# Altium schematic sheet Datalogger.SchDoc
size A3
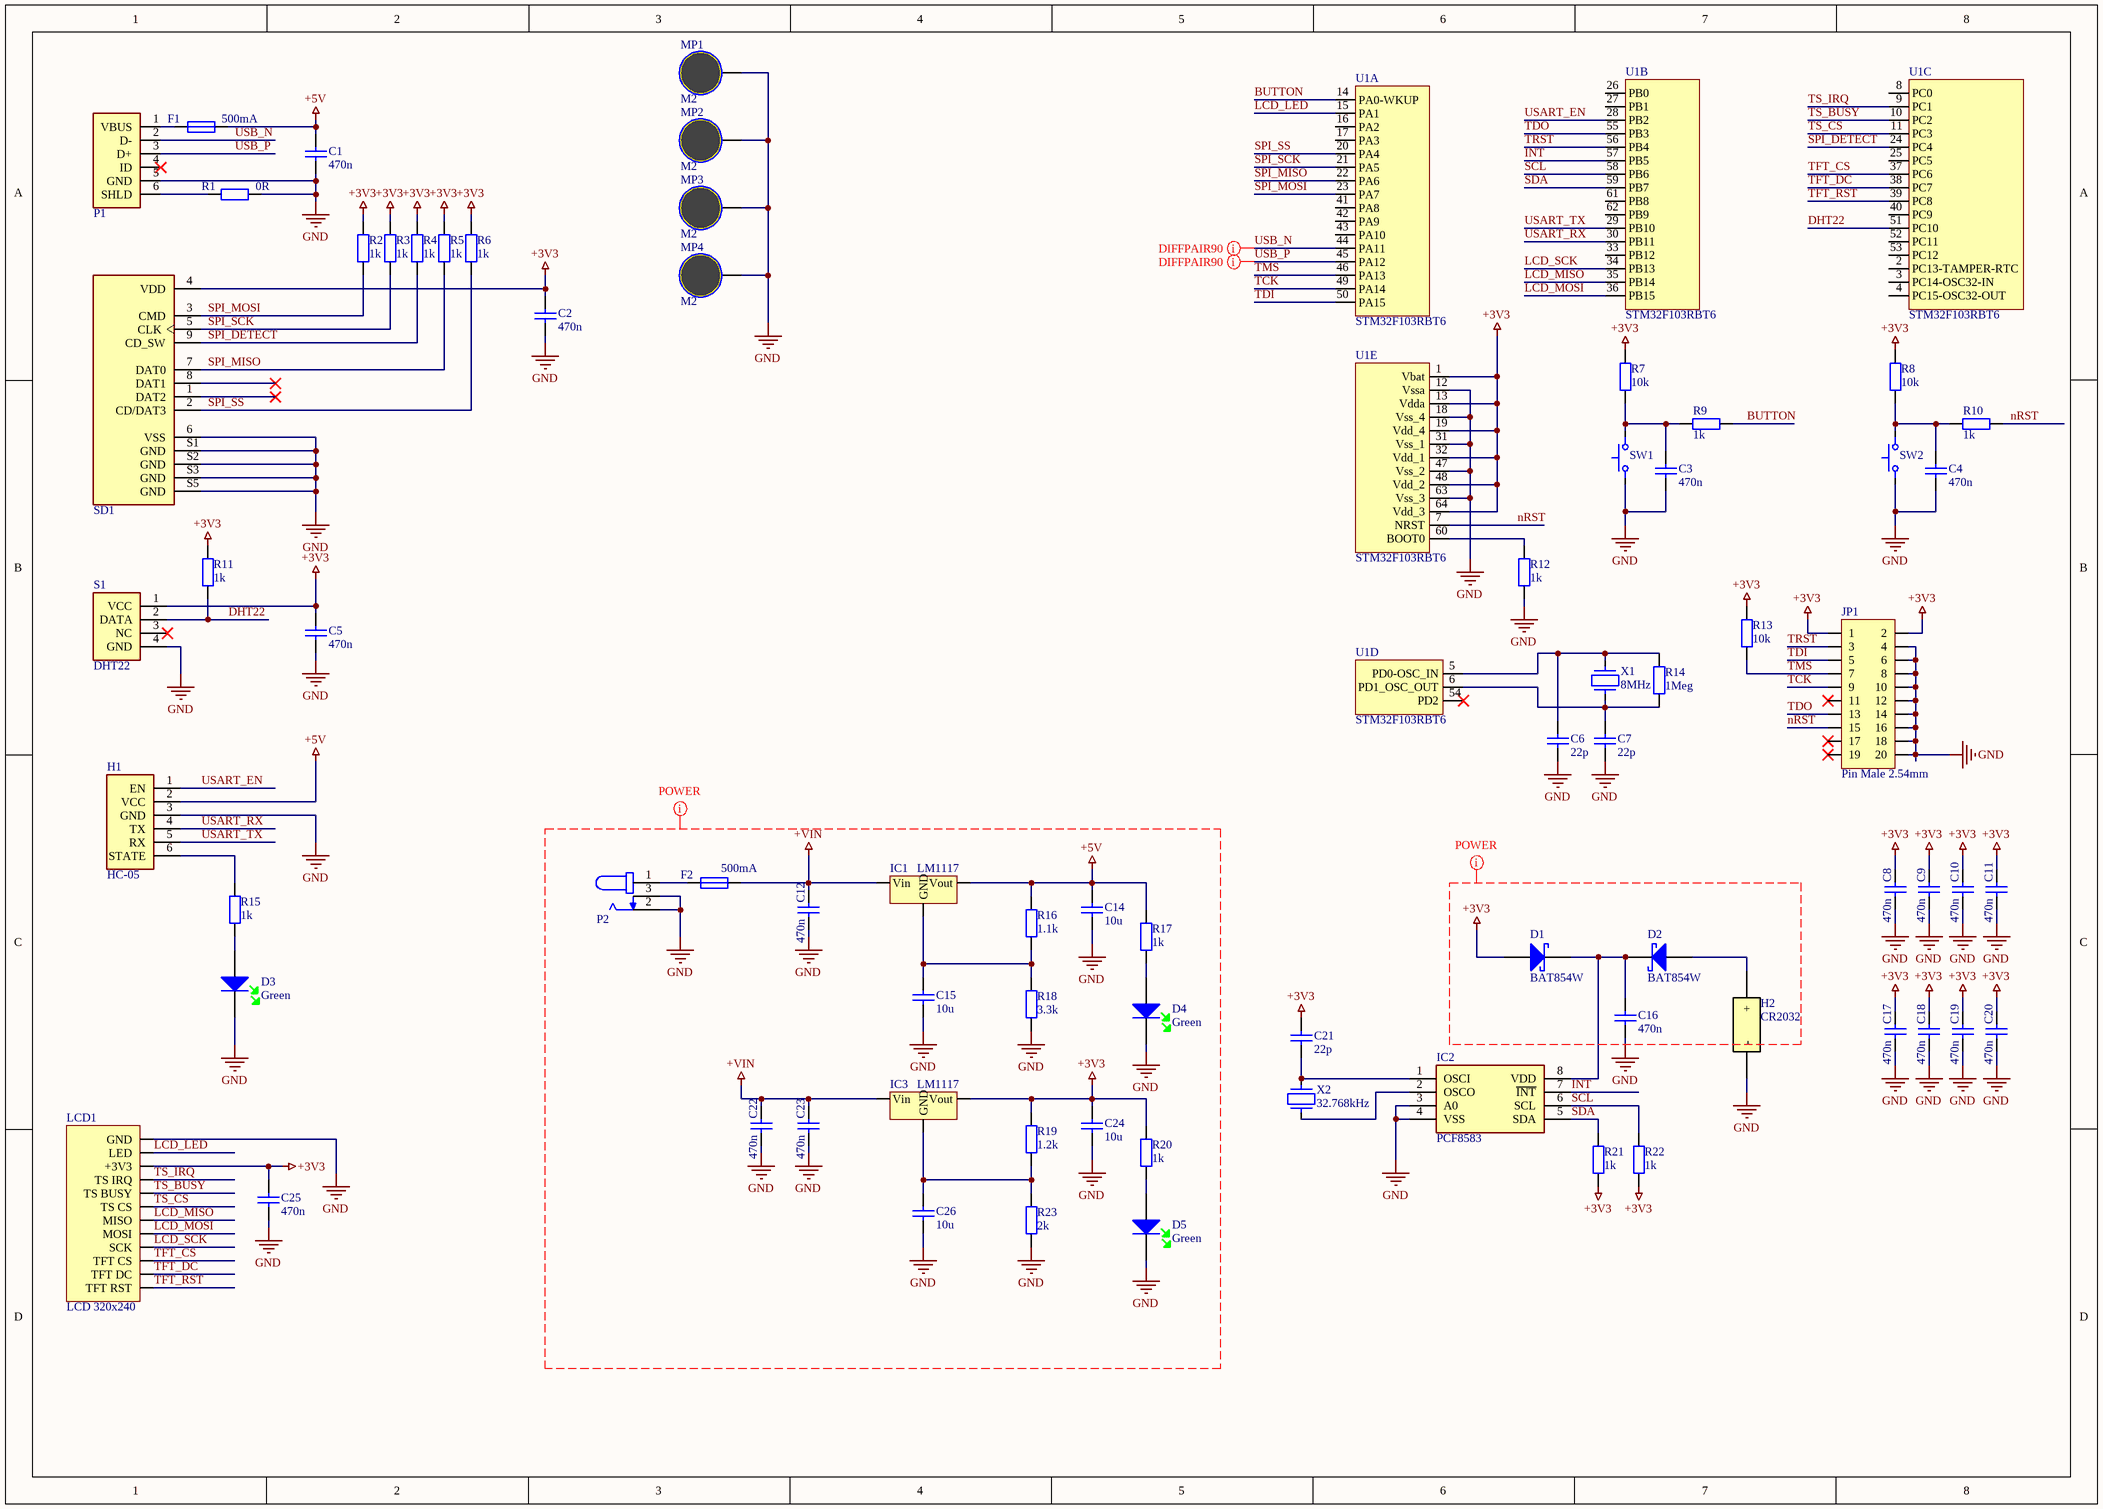
[diagram p0: Datalogger.SchDoc]

## Parts
C1  470n  [Capacitor 0603]
C2  470n  [Capacitor 0603]
C3  470n  [Capacitor 0603]
C4  470n  [Capacitor 0603]
C5  470n  [Capacitor 0603]
C6  22p  [Capacitor 0603]
C7  22p  [Capacitor 0603]
C8  470n  [Capacitor 0603]
C9  470n  [Capacitor 0603]
C10  470n  [Capacitor 0603]
C11  470n  [Capacitor 0603]
C12  470n  [Capacitor 0603]
C14  10u  [Capacitor 0603]
C15  10u  [Capacitor 0603]
C16  470n  [Capacitor 0603]
C17  470n  [Capacitor 0603]
C18  470n  [Capacitor 0603]
C19  470n  [Capacitor 0603]
C20  470n  [Capacitor 0603]
C21  22p  [Capacitor 0603]
C22  470n  [Capacitor 0603]
C23  470n  [Capacitor 0603]
C24  10u  [Capacitor 0603]
C25  470n  [Capacitor 0603]
C26  10u  [Capacitor 0603]
D1  BAT854W  [SOT323_BAT]
D2  BAT854W  [SOT323_BAT]
D3  Green  [Diode LED 0603 G]
D4  Green  [Diode LED 0603 G]
D5  Green  [Diode LED 0603 G]
F1  500mA  [Fuse 0805]
F2  500mA  [Fuse 0805]
H1  HC-05  [HC05]
H2  CR2032  [CR2032 HOLDER]
IC1  LM1117  [ic lm1117]
IC2  PCF8583  [SOIC8]
IC3  LM1117  [ic lm1117]
JP1  Pin Male 2.54mm  [20 pin 2.54mm male THT JTAG]
LCD1  LCD 320x240  [LCD_PINS]
MP1  M2  [Mechanical screw M2]
MP2  M2  [Mechanical screw M2]
MP3  M2  [Mechanical screw M2]
MP4  M2  [Mechanical screw M2]
P1  Mechanical MICRO USB AB 5P SMD RA  [Mechanical microUSB]  (value not drawn)
P2  Mechanical PWR JACK 2X5.5MM SOLDER  [Mechanical CUI_PJ-002A]  (value not drawn)
R1  0R  [Resistor 0603]
R2  1k  [Resistor 0603]
R3  1k  [Resistor 0603]
R4  1k  [Resistor 0603]
R5  1k  [Resistor 0603]
R6  1k  [Resistor 0603]
R7  10k  [Resistor 0603]
R8  10k  [Resistor 0603]
R9  1k  [Resistor 0603]
R10  1k  [Resistor 0603]
R11  1k  [Resistor 0603]
R12  1k  [Resistor 0603]
R13  10k  [Resistor 0603]
R14  1Meg  [Resistor 0603]
R15  1k  [Resistor 0603]
R16  1.1k  [Resistor 0603]
R17  1k  [Resistor 0603]
R18  3.3k  [Resistor 0603]
R19  1.2k  [Resistor 0603]
R20  1k  [Resistor 0603]
R21  1k  [Resistor 0603]
R22  1k  [Resistor 0603]
R23  2k  [Resistor 0603]
S1  DHT22  [DHT22]
SD1  Mechanical microSD DM3CS-SF  [Mechanical SD card]  (value not drawn)
SW1  Mechanical Pushbutton Panel Mount  [TACTSWITCH SMD 6x6]  (value not drawn)
SW2  Mechanical Pushbutton Panel Mount  [TACTSWITCH SMD 6x6]  (value not drawn)
U1  STM32F103RBT6  [LQFP64]  (parts A,B,C,D,E of 5)
X1  8MHz  [8MHZ SMD]
X2  32.768kHz  [32.768kHz THT]

## Nets
+3V3: C2.2 C5.2 C8.2 C9.2 C10.2 C11.2 C17.2 C18.2 C19.2 C20.2 C21.2 C24.2 C25.2 D1.1 IC3.2(Vout) JP1.1 JP1.2 LCD1.3(+3V3) R2.2 R3.2 R4.2 R5.2 R6.2 R7.2 R8.2 R11.2 R13.2 R19.2 R20.2 R21.1 R22.1 S1.1(VCC) SD1.4(VDD) U1.1(Vbat) U1.13(Vdda) U1.19(Vdd_4) U1.32(Vdd_1) U1.48(Vdd_2) U1.64(Vdd_3)
+5V: C1.2 C14.2 F1.2 H1.2(VCC) IC1.2(Vout) R16.2 R17.2
+VIN: C12.2 C22.2 C23.2 F2.2 IC1.3(Vin) IC3.3(Vin)
GND: C1.1 C2.1 C3.1 C4.1 C5.1 C6.1 C7.1 C8.1 C9.1 C10.1 C11.1 C12.1 C14.1 C15.1 C16.1 C17.1 C18.1 C19.1 C20.1 C22.1 C23.1 C24.1 C25.1 C26.1 D3.1 D4.1 D5.1 H1.3(GND) H2.1(-) IC2.3(A0) IC2.4(VSS) JP1.4 JP1.6 JP1.8 JP1.10 JP1.12 JP1.14 JP1.16 JP1.18 JP1.20 LCD1.1(GND) MP1.0 MP2.0 MP3.0 MP4.0 P1.5(GND) P2.2 P2.3 R1.2 R12.1 R18.1 R23.1 S1.4(GND) SD1.6(VSS) SD1.S1(GND) SD1.S2(GND) SD1.S3(GND) SD1.S5(GND) SW1.1 SW2.1 U1.12(Vssa) U1.18(Vss_4) U1.31(Vss_1) U1.47(Vss_2) U1.63(Vss_3)
BUTTON: R9.2 U1.14(PA0-WKUP)
DHT22: R11.1 S1.2(DATA) U1.51(PC10)
~{INT}: IC2.7(~{INT}) U1.57(PB5)
LCD_LED: LCD1.2(LED) U1.15(PA1)
LCD_MISO: LCD1.7(MISO) U1.35(PB14)
LCD_MOSI: LCD1.8(MOSI) U1.36(PB15)
LCD_SCK: LCD1.9(SCK) U1.34(PB13)
nRST: JP1.15 R10.2 U1.7(NRST)
SCL: IC2.6(SCL) R22.2 U1.58(PB6)
SDA: IC2.5(SDA) R21.2 U1.59(PB7)
SPI_DETECT: R4.1 SD1.9(CD_SW) U1.24(PC4)
SPI_MISO: R5.1 SD1.7(DAT0) U1.22(PA6)
SPI_MOSI: R2.1 SD1.3(CMD) U1.23(PA7)
SPI_SCK: R3.1 SD1.5(CLK) U1.21(PA5)
SPI_SS: R6.1 SD1.2(CD/DAT3) U1.20(PA4)
TCK: JP1.9 U1.49(PA14)
TDI: JP1.5 U1.50(PA15)
TDO: JP1.13 U1.55(PB3)
TFT_CS: LCD1.10(TFT_CS) U1.37(PC6)
TFT_DC: LCD1.11(TFT_DC) U1.38(PC7)
TFT_RST: LCD1.12(TFT_RST) U1.39(PC8)
TMS: JP1.7 R13.1 U1.46(PA13)
TRST: JP1.3 U1.56(PB4)
TS_BUSY: LCD1.5(TS_BUSY) U1.10(PC2)
TS_CS: LCD1.6(TS_CS) U1.11(PC3)
TS_IRQ: LCD1.4(TS_IRQ) U1.9(PC1)
USART_EN: H1.1(EN) U1.28(PB2)
USART_RX: H1.4(TX) U1.30(PB11)
USART_TX: H1.5(RX) U1.29(PB10)
USB_N: P1.2(D-) U1.44(PA11)
USB_P: P1.3(D+) U1.45(PA12)
NetC3_2: C3.2 R7.1 R9.1 SW1.2
NetC4_2: C4.2 R8.1 R10.1 SW2.2
NetC6_2: C6.2 R14.2 U1.5(PD0-OSC_IN) X1.2
NetC7_2: C7.2 R14.1 U1.6(PD1_OSC_OUT) X1.1
NetC15_2: C15.2 IC1.1(GND) R16.1 R18.2
NetC16_2: C16.2 D1.3 D2.3 IC2.8(VDD)
NetC21_1: C21.1 IC2.1(OSCI) X2.2
NetC26_2: C26.2 IC3.1(GND) R19.1 R23.2
NetD2_1: D2.1 H2.2(+)
NetD3_2: D3.2 R15.1
NetD4_2: D4.2 R17.1
NetD5_2: D5.2 R20.1
NetF1_1: F1.1 P1.1(VBUS)
NetF2_1: F2.1 P2.1
NetH1_6: H1.6(STATE) R15.2
NetIC2_2: IC2.2(OSCO) X2.1
NetP1_6: P1.6(SHLD) R1.1
NetR12_2: R12.2 U1.60(BOOT0)

Not connected (* = marked no-connect by the designer): JP1 11* 17* 19*; P1 4(ID)*; S1 3(NC)*; SD1 1(DAT2)* 8(DAT1)*; U1 2(PC13-TAMPER-RTC) 3(PC14-OSC32-IN) 4(PC15-OSC32-OUT) 8(PC0) 16(PA2) 17(PA3) 25(PC5) 26(PB0) 27(PB1) 33(PB12) 40(PC9) 41(PA8) 42(PA9) 43(PA10) 52(PC11) 53(PC12) 54(PD2)* 61(PB8) 62(PB9)

## Layout directives
net class POWER: +3V3, +5V, +VIN, GND
differential pair: USB_N, USB_P

## Library data of the parts
C1-C5 C25 = Capacitor 470n: Cap Ceramic 0.47uF 50V Y5V -20% to 80% SMD 0603 85C Paper T/R; Manufacturer: Samsung; Manufacturer Part Number: CL10F474ZB8NNNC; Capacitance: 470nF; Supplier 1: Arrow; Stock 1: 53041; Pricing 1: 1=0.1235, 10=0.0893, 25=0.0884, 100=0.0414, 250=0.0409, 500=0.0284, 1000=0.0233, 3000=0.0195, 6000=0.0148, 15000=0.0147, 30000=0.0138, 200000=0.014, 300000=0.0138, 400000=0.0137, 500000=0.0135, 4000=0.0244 (USD); Mount: Surface Mount; Case/Package: 0603; Case Code (Metric): 1608; Case Code (Imperial): 0603; Min Operating Temperature: -30°C; Max Operating Temperature: 85°C; Tolerance: 80%; Package Quantity: 1; Packaging: Tape and Reel; Voltage Rating: 50V; Dielectric: Y5V; Voltage Rating (DC): 50V; Length: 1.6mm; Height: 0.8mm; Width: 0.031inch; Thickness: 0.035inch; Depth: 0.8mm; Radiation Hardening: No; ComponentLink1URL: http://www.samsungsem.com/kr/support/library/product-catalog/mlcc.jsp?src-supplier=Digi-Key; ComponentLink1Description: http://www.samsungsem.com/kr/support/library/product-catalog/mlcc.jsp?src-supplier=Digi-Key; Supplier Part Number 1: CL10F474ZB8NNNC
C6 C7 C21 = Capacitor 22p 0603
C8-C12 C16-C20 C22 C23 = Capacitor 470n 0603
C14 C15 C24 C26 = Capacitor 10u 0603
D1 D2 = Diode BAT854W: DIODE SCHOTTKY 40V 200MA SOT323; Manufacturer: Nexperia; Manufacturer Part Number: BAT854W,115; Supplier 1: Digi-Key; Stock 1: 6583; Pricing 1: 1=0.3, 10=0.249, 25=0.2088, 100=0.102, 250=0.10036, 500=0.08508, 1000=0.05911 (USD); ComponentLink1URL: http://www.farnell.com/datasheets/2342726.pdf?src-supplier=Farnell; ComponentLink1Description: http://www.farnell.com/datasheets/2342726.pdf?src-supplier=Farnell; ComponentLink2URL: https://assets.nexperia.com/documents/data-sheet/BAT854W_SERIES.pdf?src-supplier=Digi-Key; ComponentLink2Description: https://assets.nexperia.com/documents/data-sheet/BAT854W_SERIES.pdf?src-supplier=Digi-Key; ComponentLink3URL: http://www.farnell.com/datasheets/2342726.pdf?src-supplier=Newark; ComponentLink3Description: http://www.farnell.com/datasheets/2342726.pdf?src-supplier=Newark; Supplier Part Number 1: 1727-6178-1-ND
D3-D5 = Diode LED GREEN CLEAR SMD: LED Uni-Color Green 574nm 2-Pin Chip LED T/R; Manufacturer: Vishay Lite-On; Manufacturer Part Number: LTST-C191KGKT; Lens Color: Colorless; Power Rating: 75mW; Luminous Intensity: 35mcd; Viewing Angle: 130°; Lens Style: Rectangular,Colorless; Forward Current: 30mA; Forward Voltage: 2V; Dominant Wavelength: 571nm; Test Current: 20mA; Lens Transparency: Clear; Number of Elements: 1; Reverse Voltage: 5V; Supplier 1: Digi-Key; Stock 1: 412024; Pricing 1: 1=0.26, 10=0.192, 100=0.0909, 500=0.0606, 1000=0.04747, 2500=0.04646 (USD); Mount: Surface Mount; Case/Package: 0603; Number of Pins: 2; Color: Green; Case Code (Metric): 1608; Case Code (Imperial): 0603; Min Operating Temperature: -55°C; Max Operating Temperature: 85°C; Packaging: Tape and Reel; Package Quantity: 1; Illumination Color: Green; Power Dissipation: 75mW; Wavelength: 574nm; Number of LEDs: 1; Max Power Dissipation: 75mW; Length: 1.6mm; Height: 0.55mm; Width: 0.8mm; Depth: 0.8mm; Radiation Hardening: No; Lead Free: Lead Free; ComponentLink1URL: http://optoelectronics.liteon.com/upload/download/DS22-2000-228/LTST-C191KGKT.PDF?src-supplier=Digi-Key; ComponentLink1Description: http://optoelectronics.liteon.com/upload/download/DS22-2000-228/LTST-C191KGKT.PDF?src-supplier=Digi-Key; Supplier Part Number 1: 160-1446-1-ND
F1 F2 = Fuse 500mA 0805
H1 = HC-05 BT module 5V UART
H2 = Mechanical CR2032 Holder: Manufacturer: Memory Protection Devices; Manufacturer Part Number: BU2032SM-FH-GTR; Supplier 1: Digi-Key; Stock 1: 3390; Pricing 1: 1=1.17, 10=0.984, 100=0.8152 (USD); ComponentLink1URL: http://www.memoryprotectiondevices.com/datasheets/BU2032SM-FH-GTR-datasheet.pdf?src-supplier=Digi-Key; ComponentLink1Description: http://www.memoryprotectiondevices.com/datasheets/BU2032SM-FH-GTR-datasheet.pdf?src-supplier=Digi-Key; Supplier Part Number 1: BU2032SM-FH-GCT-ND
IC1 IC3 = IC LM1117: STMICROELECTRONICS         L78L33ACUTR            Linear Voltage Regulator, Fixed, 8.3V To 30V In, 3.3V And 0.1A Out, SOT-89-3; Output Current: 100mA; Linear Regulator Case Style: SOT-89; No. of Pins: 3Pins; Product Range: L78L Series; SVHC: No SVHC (17-Dec-2015); Supplier 1: Digi-Key; Manufacturer: STMicroelectronics; Manufacturer Part Number: L78L33ACUTR; Stock 1: 24177; Pricing 1: 1=0.5, 10=0.408, 100=0.252, 500=0.1912, 1000=0.1434 (USD); Input Voltage Min: 8.3V; Input Voltage Max: 30V; Output Voltage Nom.: 3.3V; Operating Temperature Min: 0°C; Operating Temperature Max: 125°C; Packaging: Cut Tape; MSL: MSL 1 - Unlimited; ComponentLink1URL: http://www.st.com/content/ccc/resource/technical/document/datasheet/15/55/e5/aa/23/5b/43/fd/CD00000446.pdf/files/CD00000446.pdf/jcr:content/translations/en.CD00000446.pdf?src-supplier=Digi-Key; ComponentLink1Description: http://www.st.com/content/ccc/resource/technical/document/datasheet/15/55/e5/aa/23/5b/43/fd/CD00000446.pdf/files/CD00000446.pdf/jcr:content/translations/en.CD00000446.pdf?src-supplier=Digi-Key; ComponentLink2URL: http://www.farnell.com/datasheets/1897877.pdf?src-supplier=Element14; ComponentLink2Description: http://www.farnell.com/datasheets/1897877.pdf?src-supplier=Element14; ComponentLink3URL: http://www.mouser.com/ds/2/389/l78l-974102.pdf?src-supplier=Mouser; ComponentLink3Description: http://www.mouser.com/ds/2/389/l78l-974102.pdf?src-supplier=Mouser; ComponentLink4URL: http://www.produktinfo.conrad.com/datenblaetter/1100000-1199999/001184652-da-01-en-IC_REG_LDO_3_3V_L78L33ACUTR_SOT_89_3_STM.pdf?src-supplier=Conrad; ComponentLink4Description: http://www.produktinfo.conrad.com/datenblaetter/1100000-1199999/001184652-da-01-en-IC_REG_LDO_3_3V_L78L33ACUTR_SOT_89_3_STM.pdf?src-supplier=Conrad; Supplier Part Number 1: 497-1200-1-ND
IC2 = IC PCF8583: IC RTC CLK/CALENDAR I2C 8-SOIC; Manufacturer: NXP Semiconductors; Manufacturer Part Number: PCF8583T/5,518; Max Supply Voltage: 6V; Min Supply Voltage: 2.5V; Memory Size: 240B; Logic Function: Clock; Time Format: HH:MM:SS:hh; Supplier 1: Digi-Key; Stock 1: 1331; Pricing 1: 1=2.82, 10=2.536, 25=2.3928, 100=2.0386, 250=1.91416, 500=1.6749 (USD); Mount: Surface Mount; Case/Package: SO; Number of Pins: 8; Contact Plating: Gold; Min Operating Temperature: -40°C; Max Operating Temperature: 85°C; Packaging: Tape and Reel; Interface: I2C; Package Quantity: 1000; Radiation Hardening: No; REACH SVHC: No SVHC; Lead Free: Lead Free; ComponentLink1URL: https://www.nxp.com/docs/en/data-sheet/PCF8583.pdf?src-supplier=Digi-Key; ComponentLink1Description: https://www.nxp.com/docs/en/data-sheet/PCF8583.pdf?src-supplier=Digi-Key; ComponentLink2URL: http://www.nxp.com/documents/data_sheet/PCF8583.pdf?src-supplier=Digi-Key; ComponentLink2Description: http://www.nxp.com/documents/data_sheet/PCF8583.pdf?src-supplier=Digi-Key; ComponentLink3URL: http://www.farnell.com/datasheets/954507.pdf?src-supplier=Element14; ComponentLink3Description: http://www.farnell.com/datasheets/954507.pdf?src-supplier=Element14; ComponentLink4URL: http://www.nxp.com/documents/data_sheet/PCF8583.pdf?src-supplier=Future+Electronics; ComponentLink4Description: http://www.nxp.com/documents/data_sheet/PCF8583.pdf?src-supplier=Future+Electronics; ComponentLink5URL: http://datasheet.iiic.cc/nxp_semiconductors/PCF8583T_5,518.pdf?src-supplier=IIIC; ComponentLink5Description: http://datasheet.iiic.cc/nxp_semiconductors/PCF8583T_5,518.pdf?src-supplier=IIIC; Supplier Part Number 1: 568-1085-6-ND
JP1 = 20 pin 2.54mm male THT JTAG: CONN HEADER VERT 20POS 2.54MM; Manufacturer: Sullins; Manufacturer Part Number: SBH11-PBPC-D10-ST-BK; Product Training Modules: Box Header Line / IDC Header Line; Product Change Notification: Reflow Processing Not Recommended 05/Apr/2012; Catalog Drawings: Straight 2.54mm Male; Featured Product: Fully Shrouded Box Headers; Connector Type: Header, Shrouded; Number of Positions: 20; Number of Positions Loaded: All; Pitch: 0.100" (2.54mm); Dynamic Catalog: SBH Series; Mating Products: S9321-ND / - CONN SOCKET IDC 20POS W/STR GOLD / S9309-ND / - CONN SOCKET IDC 20POS W/STR GOLD / S9299-ND / - CONN SOCKET IDC 20POS W/O KEY AU / S9289-ND / - CONN SOCKET IDC 20POS W/KEY GOLD / S9205-ND / - CONN HEADR FMALE 20PS .1" R/A AU / S9197-ND / - CONN HEADR FMALE 20POS .1" DL AU; Other Names: S9172; Supplier 1: Digi-Key; Stock 1: 21064; Pricing 1: 1=0.54, 10=0.51, 100=0.3912, 500=0.3402, 1000=0.2807, 5000=0.2467, 10000=0.2457 (USD); Standard Package: 1; Category: Connectors, Interconnects; Family: Rectangular Connectors - Headers, Male Pins; Series: SBH11; Contact Type: Male Pin; Number of Rows: 2; Row Spacing: 0.100" (2.54mm); Mounting Type: Through Hole; Termination: Solder; Contact Finish: Gold; Contact Finish Thickness: Flash; Color: Black; Packaging: Tray; ComponentLink1URL: https://s3.amazonaws.com/catalogspreads-pdf/PAGE122%20.100%20SBH11%20SERIES%20MALE%20BOX%20HDR%20ST%20RA%20SMT.pdf?src-supplier=Digi-Key; ComponentLink1Description: https://s3.amazonaws.com/catalogspreads-pdf/PAGE122%20.100%20SBH11%20SERIES%20MALE%20BOX%20HDR%20ST%20RA%20SMT.pdf?src-supplier=Digi-Key; Supplier Part Number 1: S9172-ND
LCD1 = LCD Wemos 2.4“ inch 320×240 TFT LCD Touch Screen shield: Wemos 2.4“ inch 320×240 TFT LCD Touch Screen shield
MP1-MP4 = Mechanical screw M2
P1 = Mechanical MICRO USB AB 5P SMD RA: CONN RCPT MICRO USB AB 5P SMD RA; Manufacturer: Molex; Manufacturer Part Number: 0475900001; Number of Contacts: 5; Gender: Receptacle; Number of Ports: 1; Max Voltage Rating (AC): 100V; Pitch: 0.65mm; Supplier 1: Digi-Key; Stock 1: 8334; Pricing 1: 1=0.78, 10=0.682, 25=0.6416, 50=0.6148, 100=0.5881, 250=0.5346, 500=0.48114 (USD); Mount: Surface Mount,Horizontal; Contact Material: Copper Alloy; Contact Plating: Gold; Number of Terminals: 5; Housing Material: Polymer; Min Operating Temperature: -20°C; Max Operating Temperature: 85°C; Packaging: Tape and Reel; Connector Type: USB; Termination: Solder; Orientation: Right Angle; Package Quantity: 1; Features: Shielded; Length: 8.65mm; Depth: 5.8mm; ComponentLink1URL: https://www.molex.com/pdm_docs/sd/475900001_sd.pdf?src-supplier=Digi-Key; ComponentLink1Description: https://www.molex.com/pdm_docs/sd/475900001_sd.pdf?src-supplier=Digi-Key; Supplier Part Number 1: WM17144CT-ND
P2 = Mechanical PWR JACK 2X5.5MM SOLDER: Conn Power F 2 POS Solder RA Thru-Hole 3 Terminal 1 Port; Manufacturer: CUI; Manufacturer Part Number: PJ-002A; Gender: Male; Shielding: Unshielded; Current Rating: 2.5A; Voltage Rating: 24V; Insulation Resistance: 50MR; Number of Conductors: 2; Supplier 1: Digi-Key; Stock 1: 35595; Pricing 1: 1=0.6, 10=0.558, 25=0.5024, 50=0.4464, 100=0.4278, 250=0.3906, 500=0.372, 1000=0.3069, 2500=0.279 (USD); Mount: Through Hole; Color: Black; Contact Material: Copper Alloy,Copper; Contact Plating: Tin,Nickel; Housing Color: Black; Housing Material: Thermoplastic; Min Operating Temperature: -25°C; Max Operating Temperature: 85°C; Termination: Through Hole; Connector Type: Jack; Packaging: Bulk; Package Quantity: 500; Contact Gender: Male; Orientation: Horizontal; Diameter: 2.1mm; Lead Free: Lead Free; Flammability Rating: UL94 V-0; Supplier Part Number 1: CP-002A-ND
R1 = Resistor 0R 0603
R2-R6 R9-R12 R15 R17 R20-R22 = Resistor 1k 0603
R7 R8 R13 = Resistor 10k 0603
R14 = Resistor 1Meg 0603
R16 = Resistor 1.1k 0603
R18 = Resistor 3.3k 0603
R19 = Resistor 1.2k 0603
R23 = Resistor 2k 0603
S1 = IC DHT22: IC DHT22 1-Wire
SW1 SW2 = Mechanical Pushbutton Panel Mount: SWITCH PUSHBUTTON SPST 3A 125V; Manufacturer: E-Switch; Manufacturer Part Number: PS1023BBLK; Voltage Rating AC: 250 V; Supplier 1: Digi-Key; Stock 1: 344; Pricing 1: 1=1.54, 10=1.436, 25=1.368, 50=1.2996, 100=1.2654, 250=1.2312, 500=1.1628, 1000=1.0944, 5000=0.9234 (USD); Product Category: Pushbutton Switches; RoHS: Details; Current Rating: 3 A; Brand: E-Switch; Packaging: Bulk; Series: PS1023; ComponentLink1URL: https://media.digikey.com/pdf/Data%20Sheets/E-Switch%20PDFs/PS1023BBLK.pdf?src-supplier=Digi-Key; ComponentLink1Description: https://media.digikey.com/pdf/Data%20Sheets/E-Switch%20PDFs/PS1023BBLK.pdf?src-supplier=Digi-Key; Supplier Part Number 1: EG5932-ND
U1 = IC STM32F103RBT6
X1 = Crystal 8MHZ SMD: CRYSTAL 8.0000MHZ 18PF SMD; Manufacturer: TXC; Manufacturer Part Number: 9C-8.000MEEJ-T; Catalog Drawings: 9C Series Side 1 / 9C Series Side 2 / 9C Series Bottom; Frequency Stability: ±10ppm; ESR (Equivalent Series Resistance): 80 Ohm; Operating Mode: Fundamental; Dynamic Catalog: 9C Series; Other Names: 887-1263-6; Supplier 1: Digi-Key; Stock 1: 61610; Pricing 1: 1=0.59, 10=0.495, 50=0.4456, 100=0.396, 500=0.3762 (USD); Standard Package: 1; Category: Crystals and Oscillators; Family: Crystals; Series: 9C; Type: MHz Crystal; Frequency: 8MHz; Frequency Tolerance: ±10ppm; Load Capacitance: 18pF; Operating Temperature: -20°C ~ 70°C; Mounting Type: Surface Mount; Package / Case: HC49/US; Size / Dimension: 0.449" L x 0.189" W (11.40mm x 4.80mm); Height: 0.161" (4.10mm); Packaging: Digi-Reel®; ComponentLink1URL: http://www.txccrystal.com/images/pdf/9c-accuracy.pdf?src-supplier=Digi-Key; ComponentLink1Description: http://www.txccrystal.com/images/pdf/9c-accuracy.pdf?src-supplier=Digi-Key; ComponentLink2URL: http://www.txccorp.com/download/products/quartz_crystals/2015TXC_9C_32.pdf?src-supplier=Digi-Key; ComponentLink2Description: http://www.txccorp.com/download/products/quartz_crystals/2015TXC_9C_32.pdf?src-supplier=Digi-Key; ComponentLink3URL: http://www.farnell.com/datasheets/1497895.pdf?src-supplier=Element14; ComponentLink3Description: http://www.farnell.com/datasheets/1497895.pdf?src-supplier=Element14; ComponentLink4URL: http://www.mouser.com/ds/2/417/9c-13007.pdf?src-supplier=Mouser; ComponentLink4Description: http://www.mouser.com/ds/2/417/9c-13007.pdf?src-supplier=Mouser; ComponentLink5URL: http://www.farnell.com/datasheets/1794112.pdf?src-supplier=Element14; ComponentLink5Description: http://www.farnell.com/datasheets/1794112.pdf?src-supplier=Element14; Supplier Part Number 1: 887-1263-1-ND
X2 = Crystal 32.768kHz THT: CRYSTAL 32.7680KHZ 12.5PF T/H; Manufacturer: Abracon; Manufacturer Part Number: AB15T-32.768KHZ; Tolerance: 20 PPM; Case Diameter: 1.4 mm; Case Length: 5 mm; ESR: 40 kOhms; Supplier 1: Digi-Key; Stock 1: 2689; Pricing 1: 1=1.41, 10=1.344, 50=1.3126, 100=1.125, 500=1.0938, 1000=0.9219, 2500=0.875 (USD); Product Category: Crystals; RoHS: Details; Brand: ABRACON; Frequency: 32.768 kHz; Load Capacitance: 12.5 pF; Termination Style: Radial; Package / Case: Cylinder; Operating Temperature Range: - 20 C to + 70 C; Dimensions: 1.4 mm Dia. x 5 mm L; Packaging: Bulk; Mounting Style: Through Hole; Series: AB15T; Factory Pack Quantity: 500; Type: Low Frequency Cylindrical Watch Crystal; ComponentLink1URL: https://abracon.com/Support/PackageDrawing/Resonators/AB15T.PDF?src-supplier=Digi-Key; ComponentLink1Description: https://abracon.com/Support/PackageDrawing/Resonators/AB15T.PDF?src-supplier=Digi-Key; ComponentLink2URL: http://www.mouser.com/ds/2/3/ab-39594.pdf?src-supplier=Mouser; ComponentLink2Description: http://www.mouser.com/ds/2/3/ab-39594.pdf?src-supplier=Mouser; ComponentLink3URL: https://www.verical.com/server-webapp/html/getDatasheet?partID=720059&src-supplier=Verical; ComponentLink3Description: https://www.verical.com/server-webapp/html/getDatasheet?partID=720059&src-supplier=Verical; ComponentLink4URL: http://www.farnell.com/datasheets/1718754.pdf?src-supplier=Element14; ComponentLink4Description: http://www.farnell.com/datasheets/1718754.pdf?src-supplier=Element14; ComponentLink5URL: http://www.abracon.com/Resonators/AB15T.pdf?src-supplier=Future+Electronics; ComponentLink5Description: http://www.abracon.com/Resonators/AB15T.pdf?src-supplier=Future+Electronics; ComponentLink6URL: http://www.abracon.com/Resonators/AB15T.pdf?src-supplier=Avnet; ComponentLink6Description: http://www.abracon.com/Resonators/AB15T.pdf?src-supplier=Avnet; Supplier Part Number 1: 535-9031-ND